# EAGLE design schematic (EAGLE 8.0.0)
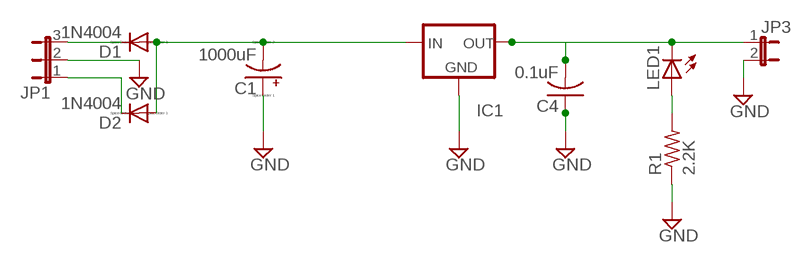
[diagram p0: schematic, sheet 1]

## Parts
C1  1000uF  CPOL-USE5-10.5  [E5-10,5]
C4  0.1uF  C-US050-025X075  [C050-025X075]
D1  1N4004  [DO41-10]
D2  1N4004  [DO41-10]
IC1  79XXS  [79XXS]
JP1  JP2E  [JP2]
JP3  JP1E  [JP1]
LED1  LED5MM  [LED5MM]
R1  2.2K  R-US_0309/12  [0309/12]

## Nets
GND: C1.+ C4.1 IC1.GND JP1.2 JP3.2 R1.1
N$1: D1.C JP1.3
N$2: D2.C JP1.1
N$3: C1.- D1.A D2.A IC1.IN
N$5: LED1.A R1.2
N$6: C4.2 IC1.OUT JP3.1 LED1.K(C)

## Library data of the parts
C1 = resistor:CPOL-US: POLARIZED CAPACITOR, American symbol
C4 = resistor:C-US: CAPACITOR, American symbol
D1 D2 = diode:1N4004: DIODE general purpose rectifier, 1 A
IC1 = v-reg:79XXS: VOLTAGE REGULATOR
JP1 = jumper:JP2E: JUMPER
JP3 = jumper:JP1E: JUMPER
LED1 = led:LED: LED OSRAM: - CHIPLED LG R971, LG N971, LY N971, LG Q971, LY Q971, LO R971, LY R971 LH N974, LH R974 LS Q976, LO Q976, LY Q976 LO Q996 - Hyper CHIPLED LW Q18S LB Q993, LB Q99A, LB R99A - SideLED LS A670, LO A670, LY A670, LG A670, LP A670 LB A673, LV A673, LT A673, LW A673 LH A674 LY A675 LS A676, LA A676, LO A676, LY A676, LW A676 LS A679, LY A679, LG A679 - Hyper Micro SIDELED® LS Y876, LA Y876, LO Y876, LY Y876 LT Y87S - SmartLED LW L88C, LW L88S LB L89C, LB L89S, LG L890 LS L89K, LO L89K, LY L89K LS L896, LA L896, LO L896, LY L896 - TOPLED LS T670, LO T670, LY T670, LG T670, LP T670 LSG T670, LSP T670, LSY T670, LOP T670, LYG T670 LG T671, LOG T671, LSG T671 LB T673, LV T673, LT T673, LW T673 LH T674 LS T676, LA T676, LO T676, LY T676, LB T676, LH T676, LSB T676, LW T676 LB T67C, LV T67C, LT T67C, LS T67K, LO T67K, LY T67K, LW E67C LS E67B, LA E67B, LO E67B, LY E67B, LB E67C, LV E67C, LT E67C LW T67C LS T679, LY T679, LG T679 LS T770, LO T770, LY T770, LG T770, LP T770 LB T773, LV T773, LT T773, LW T773 LH T774 LS E675, LA E675, LY E675, LS T675 LS T776, LA T776, LO T776, LY T776, LB T776 LHGB T686 LT T68C, LB T68C - Hyper Mini TOPLED® LB M676 - Mini TOPLED Santana® LG M470 LS M47K, LO M47K, LY M47K Source: http://www.osram.convergy.de LUXEON: - LUMILED® LXK2-PW12-R00, LXK2-PW12-S00, LXK2-PW14-U00, LXK2-PW14-V00 LXK2-PM12-R00, LXK2-PM12-S00, LXK2-PM14-U00 LXK2-PE12-Q00, LXK2-PE12-R00, LXK2-PE12-S00, LXK2-PE14-T00, LXK2-PE14-U00 LXK2-PB12-K00, LXK2-PB12-L00, LXK2-PB12-M00, LXK2-PB14-N00, LXK2-PB14-P00, LXK2-PB14-Q00 LXK2-PR12-L00, LXK2-PR12-M00, LXK2-PR14-Q00, LXK2-PR14-R00 LXK2-PD12-Q00, LXK2-PD12-R00, LXK2-PD12-S00 LXK2-PH12-R00, LXK2-PH12-S00 LXK2-PL12-P00, LXK2-PL12-Q00, LXK2-PL12-R00 Source: www.luxeon.com KINGBRIGHT: KA-3528ASYC Source: www.kingbright.com
R1 = resistor:R-US_: RESISTOR, American symbol

## Net classes
0 default: drill 0.762 mm, clearance 0.889 mm

## Board
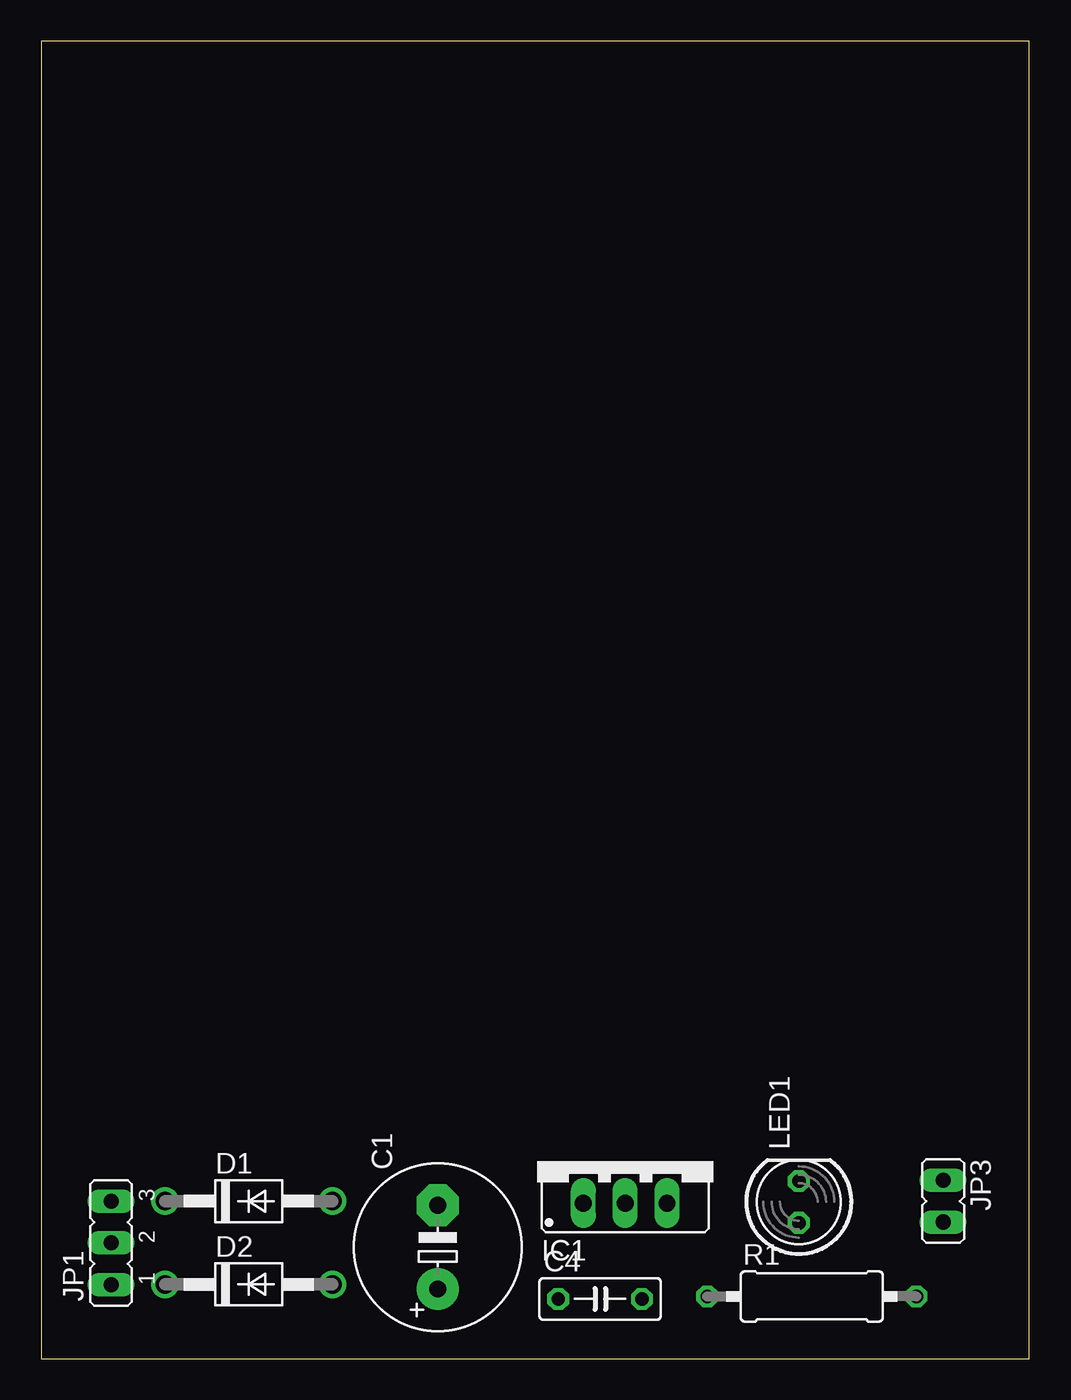
[diagram p1: board, top side]
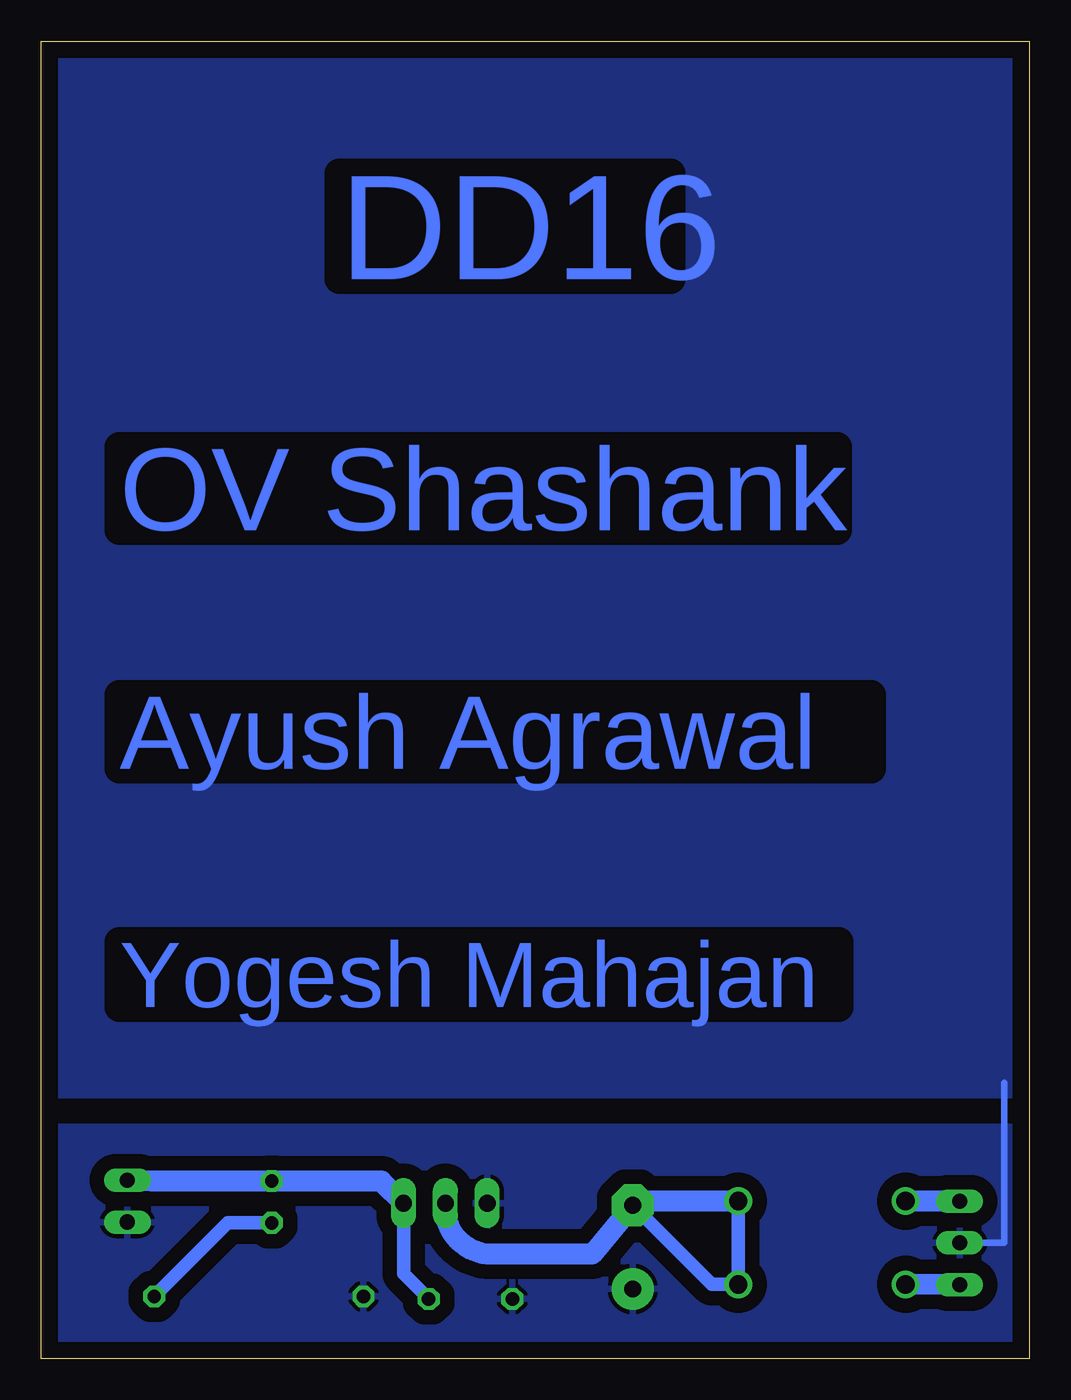
[diagram p2: board, bottom side, seen from below]

Size 60 x 80 mm. Coordinates in mm from the lower left corner, seen from the top.
Outline: 0,0 60,0 60,80 0,80 0,0
Copper layers (1*16): Top 0.035mm / dielectric 1.5mm / Bottom 0.035mm
Design rules "default *": minimum track width 16mil, minimum drill 30mil, track to track 16mil, track to pad 16mil, pad to pad 16mil, via to via 16mil, smd to smd 8mil, copper to edge 40mil, drill to drill 16mil, minimum pad ring 10mil, minimum via ring 8mil, stop-mask expansion 4mil, vias tented up to drill 0mil, thermal gap 10mil

### Footprints (pad centres in the part's own frame; a part is rotated, then mirrored left to right if it is on the bottom)
E5-10,5 = drill 1.016 pad 2.54: + -2.54,0 | drill 1.016 pad 2.54 octagon: - 2.54,0
C050-025X075 = drill 0.813 octagon: 1 -2.54,0; 2 2.54,0
DO41-10 = drill 1.118: A 5.08,0; C -5.08,0
79XXS = drill 1.016 long: GND -2.54,-2.54; IN 0,-2.54; OUT 2.54,-2.54
JP2 = drill 0.914 long: 1 -2.54,0; 2 0,0; 3 2.54,0
JP1 = drill 0.914 long: 1 0,-1.27; 2 0,1.27
LED5MM = drill 0.813 octagon: A -1.27,0; K 1.27,0
0309/12 = drill 0.813 octagon: 1 -6.35,0; 2 6.35,0

### Placement (x,y rotation side)
C1  24.08,6.78 90 top
C4  33.93,3.63 0 top
D1  12.6,9.58 0 top
D2  12.6,4.52 0 top
IC1  35.46,11.99 0 top
JP1  4.24,7.04 90 top
JP3  54.76,9.58 180 top
LED1  46,9.53 90 top
R1  46.79,3.78 0 top

### Tracks (layer width: path | path; a pad name or v marks a point on that pad's centre or on a via)
GND
  Bottom 0.406: JP1.2 1.52,7.04 1.52,16.76
  pour Bottom: -2.67,14.1 62.1,14.1 62.1,-2.67 -2.67,-2.67
  pour Bottom: -2.67,16 62.48,16 62.48,81.92 -2.67,81.92
N$1
  Bottom 1.27: JP1.3 D1.C
N$2
  Bottom 1.27: JP1.1 D2.C
N$3
  Bottom 0.813: D1.A D2.A 19.28,4.52 C1.- 23.19,9.7
  Bottom 1.27: IC1.IN arc-95 32.64,6.35 26.54,6.35 C1.- 23.82,9.58 D1.A
N$5
  Bottom 0.813: LED1.A 48.67,8.26 R1.2
N$6
  Bottom 0.813: IC1.OUT 38,5.16 C4.2
  Bottom 1.27: IC1.OUT 39.34,10.79 LED1.K 53.29,10.79 JP3.1

### Text on the board
Bottom: DD16 | OV Shashank | Ayush Agrawal | Yogesh Mahajan